# Altium schematic sheet Power.SchDoc: Power
size A4; DrawnBy: Alvin Ha; DocumentNumber: MCU2018-3; Revision: 2.0; SheetNumber: 3; SheetTotal: 4
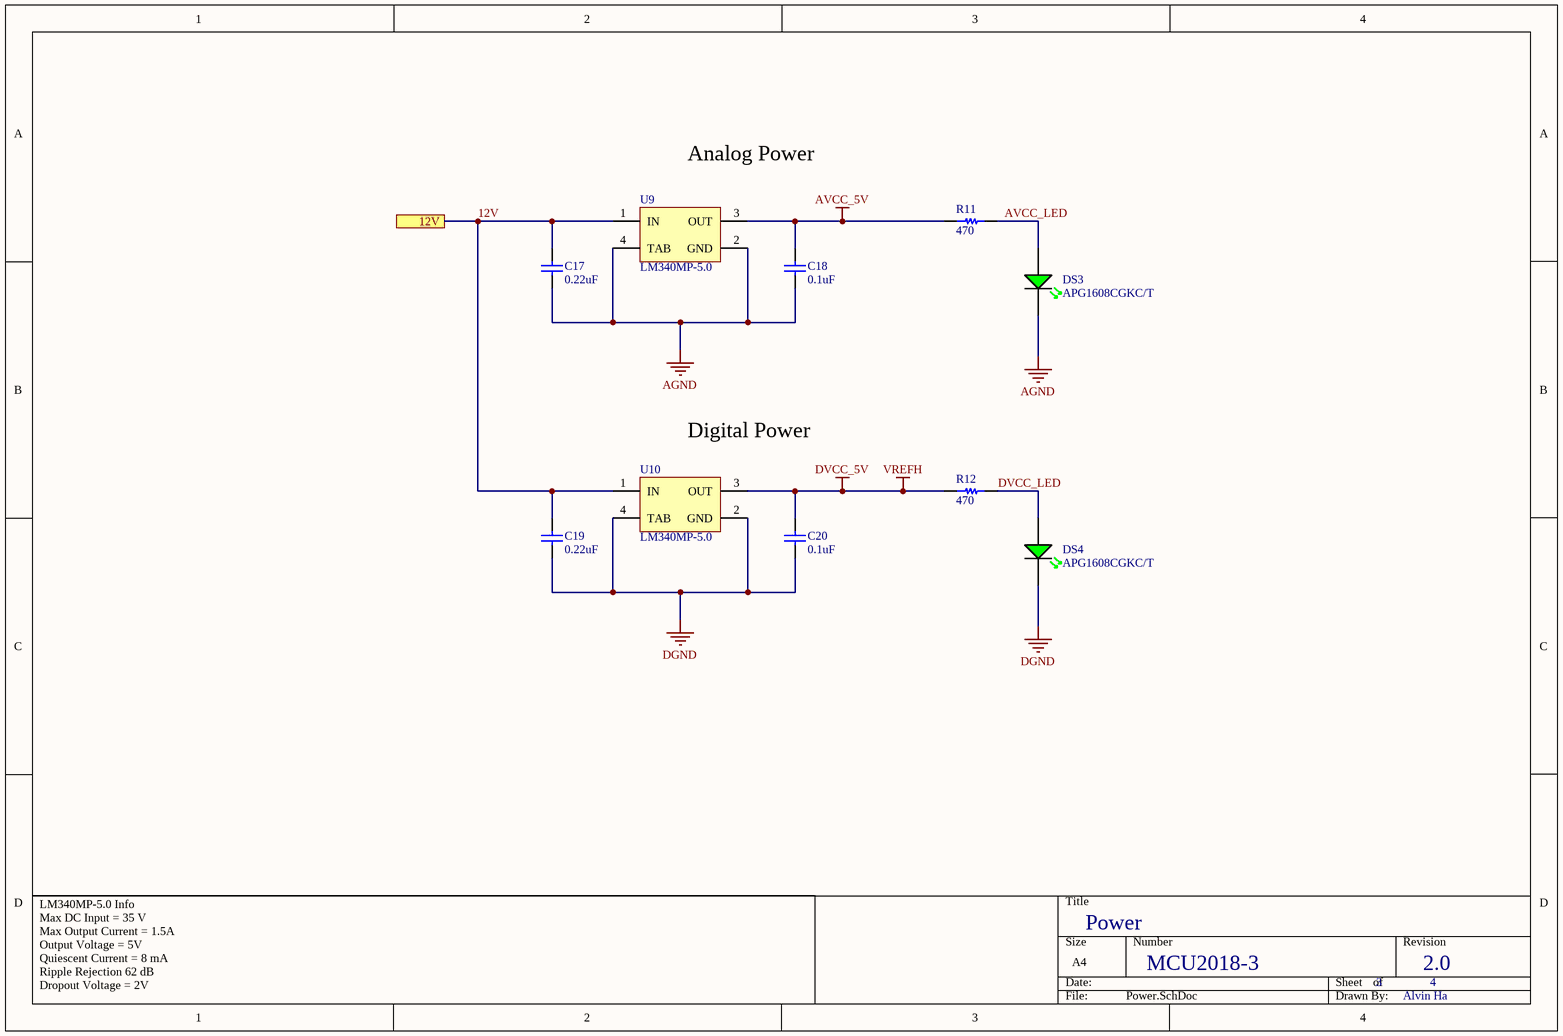
[diagram p0: Power.SchDoc]

## Parts
C17  0.22uF  [CAP SMT 0603]
C18  0.1uF  [CAP SMT 0603]
C19  0.22uF  [CAP SMT 0603]
C20  0.1uF  [CAP SMT 0603]
DS3  APG1608CGKC/T  [GREEN LED]
DS4  APG1608CGKC/T  [GREEN LED]
R11  470  [RES SMT 0805]
R12  470  [RES SMT 0805]
U9  LM340MP-5.0  [DCY0004A_M]
U10  LM340MP-5.0  [DCY0004A_M]

## Ports
12V

## Nets
AGND: C17.1 C18.1 DS3.1 U9.2(GND) U9.4(TAB)
AVCC_5V: C18.2 R11.1 U9.3(OUT)
DGND: C19.1 C20.1 DS4.1 U10.2(GND) U10.4(TAB)
DVCC_5V: C20.2 R12.1 U10.3(OUT)  [also labelled VREFH]
12V: C17.2 C19.2 U9.1(IN) U10.1(IN) ; port 12V
AVCC_LED: DS3.2 R11.2
DVCC_LED: DS4.2 R12.2

## Notes on the sheet
- Analog Power
- (near U10) Digital Power
- LM340MP-5.0 Info
  Max DC Input = 35 V
  Max Output Current = 1.5A
  Output Voltage = 5V
  Quiescent Current = 8 mA
  Ripple Rejection 62 dB
  Dropout Voltage = 2V

## Library data of the parts
C17 C19 = Capacitor 0.22uF 25V 0603: Supplier 1: Digi-Key; Supplier Part Number 1: 445-5191-6-ND
C18 C20 = Capacitor 0.1uF 25V 0603: Supplier 1: Digi-Key; Supplier Part Number 1: 445-5667-6-ND
DS3 DS4 = Green LED: Supplier 1: Digi-Key; Supplier Part Number 1: 754-1357-6-ND
R11 R12 = Resistor 470 1% 0805: Supplier 1: Digi-Key; Supplier Part Number 1: 541-470KCDKR-ND
U9 U10 = CMP-0062-01765-3: Series 3-Terminal Positive Regulators, 4-pin SOT-223; Manufacturer: Texas Instruments; CompType: LDO IC; PackageTopMarking: XYTT*N00A; PowerWise: N; PackageReference: DCY0004A; Code_IPC: SOT223-4; RoHS: N; PackageDescription: Molded SOT-223, 6.50 x 3.56 x 1.6mm Body, 4 Lead, 2.3mm Pitch; ComponentLink1URL: http://www.ti.com/general/docs/lit/getliterature.tsp?genericPartNumber=LM340-N&fileType=pdf; ComponentLink1Description: Datasheet URL; PinCount: 4; Code_JEDEC: TO-261-AA